# Altium schematic sheet Servo.SchDoc: Top Level
size A3; CompanyName: NOT USED; DocumentNumber: 5; SheetNumber: 5; SheetTotal: 10; PageSetup: Record=PageOptions|CenterHorizontal=True|CenterVertical=True|PrintScale=1.00|XCorrection=1.00|YCorrection=1.00|PrintKind=0|BorderSize=5000000|LeftOffset=0|BottomOffset=0|Orientation=2|PaperLength=1000|PaperWidth=1000|Scale=100|PaperSource=7|PrintQuality=-4|MediaType=1|DitherType=10|PaperKind=A3|PrintScaleMode=0
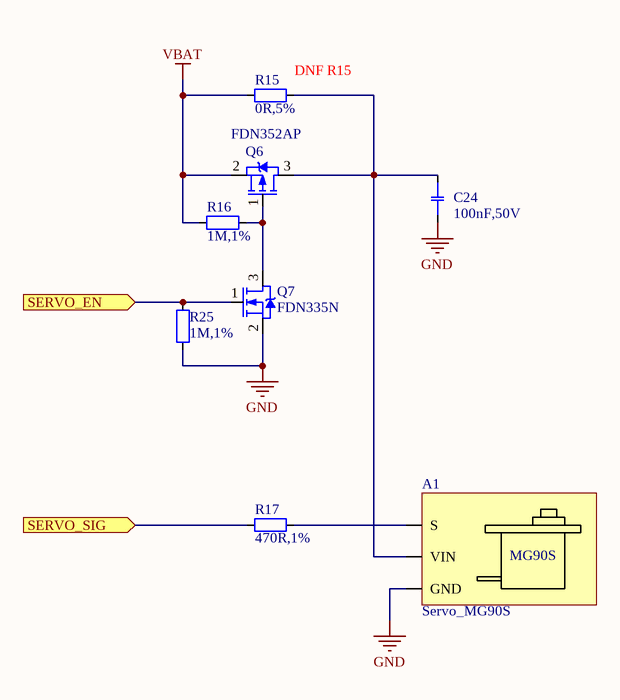
[diagram p0: Servo.SchDoc]

## Parts
A1  Servo_MG90S  [SERVO_MG90S]
C24  100nF,50V  [CAPC1608X09N_0603]
Q6  FDN352AP  [SOT95P230X110-3N_SOT23]
Q7  FDN335N  [SOT95P230X110-3N_SOT23]
R15  0R,5%  [RESC1608X06N_0603]
R16  1M,1%  [RESC1608X06N_0603]
R17  470R,1%  [RESC1608X06N_0603]
R25  1M,1%  [RESC1608X06N_0603]

## Ports
SERVO_EN (in), SERVO_SIG (in)

## Nets
GND: A1.1(GND) C24.1 Q7.2(S) R25.2
VBAT: Q6.2(S) R15.1 R16.2
SERVO_EN: Q7.1(G) R25.1 ; port SERVO_EN
SERVO_SIG: R17.2 ; port SERVO_SIG
NetA1_2: A1.2(VIN) C24.2 Q6.3(D) R15.2
NetA1_3: A1.3(S) R17.1
NetQ6_1: Q6.1(G) Q7.3(D) R16.1

## Notes on the sheet
- (near R15) DNF R15
- Project
- Size:
- Date:
- A3
- Revision:
- Sheet
- of
- Lambo
- File:
- (in symbol Servo_MG90S) MG90S

## Library data of the parts
C24 = CCH-104CH-G: CAP CER 0.1UF 50V 10% X7R 0603; Manufacturer: Kemet; Manufacturer Part Number: C0603C104K5RACTU; Type: Ceramic; Display_Name: 100nF,50V; Capacitance: 100nF; Dielectric: X7R; Tolerance: 10%; Voltage: 50V; BWA PN: CCH-104CH-G; Schematic Symbol: CAP-NP_1; Supplier 1: Digi-Key; Supplier Part Number 1: 399-5089-1-ND
Q6 = TRN-10006-A: MOSFET P-CH 30V 1.3A SSOT-3; Manufacturer: Fairchild; Type: P; Id(max): -1.3A; rds(on): 180mOhms; Vds(max): -30V; Vgs(max): +/-25V; Vth(max): -2.5V; Display_Name: FDN352AP; BWA PN: TRN-10006-A; Schematic Symbol: MOSFET-P_1; Manufacturer Part Number: FDN352AP; Supplier 1: Digi-Key; Supplier Part Number 1: FDN352APCT-ND
Q7 = TRN-10045-A: MOSFET N-CH 20V 1.7A SSOT3; Manufacturer: Fairchild Semiconductor; Type: N; rds(on): 70mOhm; Vgs(max): +/-8V; Vth(max): 1.5V; Display_Name: FDN335N; BWA PN: TRN-10045-A; Id(max): 1.7A; Vds(max): 20V; Schematic Symbol: MOSFET-N_1; Manufacturer Part Number: FDN335N; Supplier 1: Digi-Key; Supplier Part Number 1: FDN335NCT-ND
R15 = RSH-0R000-F: RES 0.0 OHM 1/10W 0603 SMD; Manufacturer: Yageo; Manufacturer Part Number: RC0603JR-070RL; Power: 0.1W; Display_Name: 0R,5%; Resistance: 0R; Tolerance: 5%; Type: Chip; BWA PN: RSH-0R000-F; Schematic Symbol: RESISTOR_1; Supplier 1: Digi-Key; Supplier Part Number 1: 311-0.0GRCT-ND
R16 R25 = RSH-1M000-D: RES 1.00M OHM 1/10W 1% 0603 SMD; Manufacturer: Yageo; Manufacturer Part Number: RC0603FR-071ML; Power: 0.1W; Display_Name: 1M,1%; Resistance: 1M; Tolerance: 1%; Type: Chip; BWA PN: RSH-1M000-D; Schematic Symbol: RESISTOR_1; Supplier 1: Digi-Key; Supplier Part Number 1: 311-1.00MHRCT-ND
R17 = RSH-470R0-D: RES 470 OHM 1/10W 1% 0603 SMD; Manufacturer: Rohm Semiconductor; Manufacturer Part Number: MCR03EZPFX4700; Power: 0.1W; Display_Name: 470R,1%; Resistance: 470R; Tolerance: 1%; Type: Chip; BWA PN: RSH-470R0-D; Schematic Symbol: RESISTOR_1; Supplier 1: Digi-Key; Supplier Part Number 1: RHM470HCT-ND